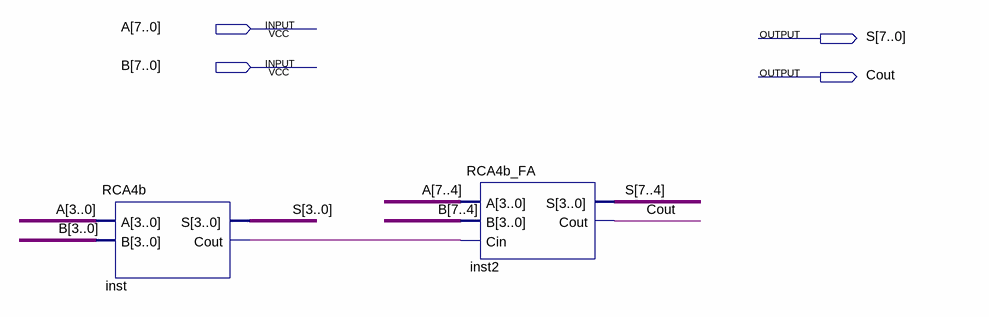
[diagram p0: schematic sheet]
// Quartus schematic RCA8.bdf as structural Verilog: 2 symbols, 4 pins
module RCA8 (
  input  [7:0] A,
  input  [7:0] B,
  output [7:0] S,
  output Cout
);

  wire inst_cout;

  RCA4b inst (.A(A[3:0]), .B(B[3:0]), .S(S[3:0]), .Cout(inst_cout));
  RCA4b_FA inst2 (.A(A[7:4]), .B(B[7:4]), .Cin(inst_cout), .S(S[7:4]), .Cout(Cout));
endmodule
